# Altium schematic sheet 开关量输入.SchDoc
size A3
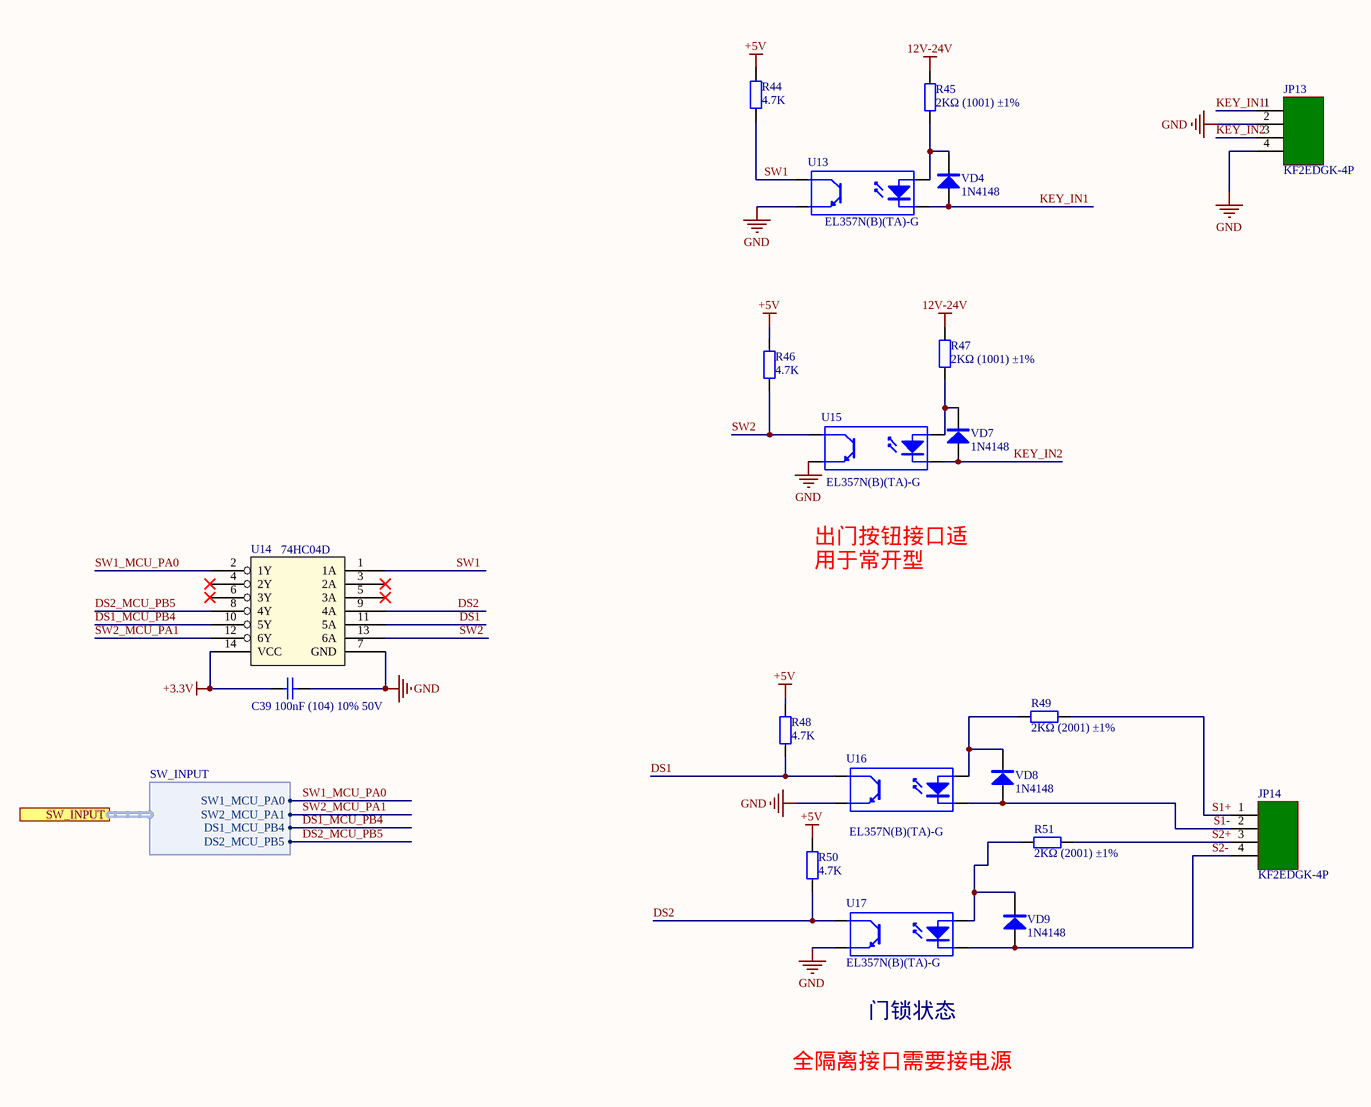
[diagram p0: 开关量输入.SchDoc]

## Parts
C39  100nF (104) 10% 50V  [0603_C]
JP13  KF2EDGK-4P  [KF2EDGK5.08W-4P]
JP14  KF2EDGK-4P  [KF2EDGK5.08W-4P]
R44  4.7K  [0603_R]
R45  2KΩ (1001) ±1%  [0603_R]
R46  4.7K  [0603_R]
R47  2KΩ (1001) ±1%  [0603_R]
R48  4.7K  [0603_R]
R49  2KΩ (2001) ±1%  [0805_R]
R50  4.7K  [0603_R]
R51  2KΩ (2001) ±1%  [0805_R]
U13  EL357N(B)(TA)-G  [SOP-4_P2.54]
U14  74HC04D  [SOIC-14_150mil]
U15  EL357N(B)(TA)-G  [SOP-4_P2.54]
U16  EL357N(B)(TA)-G  [SOP-4_P2.54]
U17  EL357N(B)(TA)-G  [SOP-4_P2.54]
VD4  1N4148  [MINI_MELF (LL34)]
VD7  1N4148  [MINI_MELF (LL34)]
VD8  1N4148  [MINI_MELF (LL34)]
VD9  1N4148  [MINI_MELF (LL34)]

## Ports
SW_INPUT (harness SW_INPUT)

## Harnesses
SW_INPUT: SW1_MCU_PA0, SW2_MCU_PA1, DS1_MCU_PB4, DS2_MCU_PB5

## Nets
12V-24V: R45.2 R47.2
+3.3V: C39.1 U14.14(VCC)
+5V: R44.2 R46.2 R48.2 R50.2
GND: C39.2 JP13.2 JP13.4 U13.3(E) U14.7(GND) U15.3(E) U16.3(E) U17.3(E)
DS1: R48.1 U14.11(5A) U16.4(C)
DS1_MCU_PB4: U14.10(5Y) ; port SW_INPUT.DS1_MCU_PB4
DS2: R50.1 U14.9(4A) U17.4(C)
DS2_MCU_PB5: U14.8(4Y) ; port SW_INPUT.DS2_MCU_PB5
KEY_IN1: JP13.1 U13.2(K) VD4.1(A)
KEY_IN2: JP13.3 U15.2(K) VD7.1(A)
S1+: JP14.1 R49.2
S1-: JP14.2 U16.2(K) VD8.1(A)
S2+: JP14.3 R51.2
S2-: JP14.4 U17.2(K) VD9.1(A)
SW1: R44.1 U13.4(C) U14.1(1A)
SW1_MCU_PA0: U14.2(1Y) ; port SW_INPUT.SW1_MCU_PA0
SW2: R46.1 U14.13(6A) U15.4(C)
SW2_MCU_PA1: U14.12(6Y) ; port SW_INPUT.SW2_MCU_PA1
NetR45_1: R45.1 U13.1(A) VD4.2(K)
NetR47_1: R47.1 U15.1(A) VD7.2(K)
NetR49_1: R49.1 U16.1(A) VD8.2(K)
NetR51_1: R51.1 U17.1(A) VD9.2(K)

Not connected (* = marked no-connect by the designer): U14 3(2A)* 4(2Y)* 5(3A)* 6(3Y)*

## Notes on the sheet
- 出门按钮接口适用于常开型
- (near U17) 门锁状态
- 全隔离接口需要接电源

## Library data of the parts
C39 = 0603 100nF (104) 10% 50V: 贴片电容; ComponentLink1Description: 供应商链接; ComponentLink1URL: http://www.szlcsc.com/product/details_15331.html; Package: 0603; Supplier: LC; SuppliersPartNumber: C14663
R44-R48 R50 = 0603 1KΩ (1001) 1%: 贴片电阻; ComponentLink1Description: 供应商链接; ComponentLink1URL: http://www.szlcsc.com/product/details_21904.html; Package: 0603; Supplier: LC; SuppliersPartNumber: C21190
R49 R51 = 0805 2KΩ (2001) 1%: 贴片电阻; ComponentLink1Description: 供应商链接; ComponentLink1URL: http://www.szlcsc.com/product/details_18292.html; Package: 0805; Supplier: LC; SuppliersPartNumber: C17604
U13 U15-U17 = EL357N(B)(TA)-G: 贴片光耦; ComponentLink1Description: 供应商链接; ComponentLink1URL: http://www.szlcsc.com/product/details_7114.html; Package: SOP-4_P2.54; Supplier: LC; SuppliersPartNumber: C6649
U14 = 74HC04D: 反相器; ComponentLink1Description: 供应商; ComponentLink1URL: https://item.szlcsc.com/87790.html
VD4 VD7-VD9 = 1N4148: 高速开关二极管; 版权归属: 源创客; BOM名称: 高速开关二极管; 学习资源: www.ooocke.com